# EAGLE schematic dashbutton_2450_v3 (EAGLE 9.1.3)
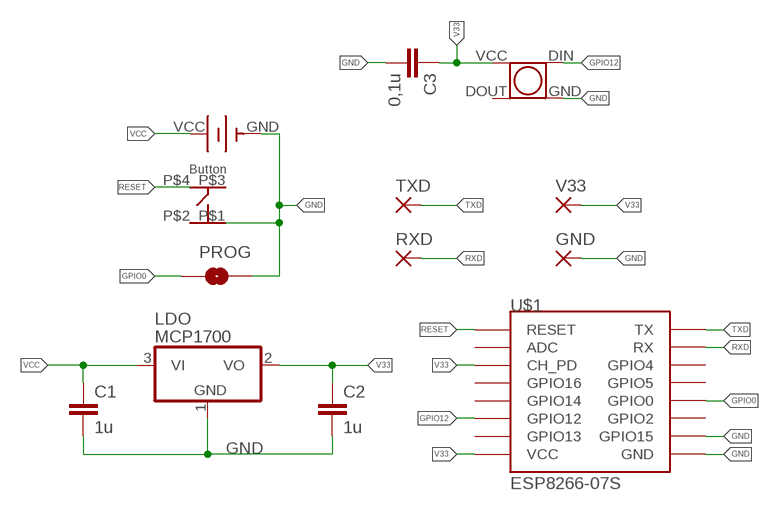
[diagram p0: schematic, sheet 1]

## Parts
BUTTON  OMRON_B3FS_BUTTON  [BUTTON_OMRON_B3FS]
C1  1u  C-EUC1206  [C1206]
C2  1u  C-EUC1206  [C1206]
C3  0,1u  C-EUC1206  [C1206]
GND  WIREPADSMD1,27-254  [SMD1,27-2,54]
LDO  MCP1700  MCP1703CB  [SOT23]
PROG  JUMPER-SMT_2_NO_NO-SILK  [SMT-JUMPER_2_NO_NO-SILK]
RXD  WIREPADSMD1,27-254  [SMD1,27-2,54]
TXD  WIREPADSMD1,27-254  [SMD1,27-2,54]
U$1  ESP8266-07S  [ESP8266-07S]
U$2  2450_BATTERYHOLDER_SMD  [2450_BATTERYHOLDER_SMD]
U$3  WS2812B  [WS2812B]
V33  WIREPADSMD1,27-254  [SMD1,27-2,54]

## Nets
GND: BUTTON.P$1(P1) C1.2 C2.2 C3.2 GND.1(P) LDO.1(GND) PROG.2 U$1.GND U$1.GPIO15 U$2.GND U$3.GND
GPIO0: PROG.1 U$1.GPIO0
GPIO12: U$1.GPIO12 U$3.DIN
RESET: BUTTON.P$4(P4) U$1.RST(RESET)
RXD: RXD.1(P) U$1.RXD(RX)
TXD: TXD.1(P) U$1.TXD(TX)
V33: C2.1 C3.1 LDO.2(VO) U$1.EN(CH_PD) U$1.VCC U$3.VCC V33.1(P)
VCC: C1.1 LDO.3(VI) U$2.VCC
Unconnected: BUTTON.P$2(P2) BUTTON.P$3(P3) U$1.ADC U$1.GPIO2 U$1.GPIO4 U$1.GPIO5 U$1.GPIO13 U$1.GPIO14 U$1.GPIO16 U$3.DOUT

## Library data of the parts
BUTTON = moekoe:OMRON_B3FS_BUTTON
C1-C3 = rcl:C-EU: CAPACITOR, European symbol; SPICEPREFIX: C
GND RXD TXD V33 = wirepad:WIREPAD: Wire PAD connect wire on PCB
LDO = linear:MCP1703: 250 mA, 16V, Low Quiescent Current LDO Regulator Source: http://ww1.microchip.com/downloads/en/DeviceDoc/22049b.pdf
PROG = SparkFun-Jumpers:JUMPER-SMT_2_NO: Normally open jumper This jumper has two pads in close proximity to each other. Apply solder to close the connection. Round pads are easier to solder for beginners, but are a lot larger. SparkFun Product that uses the round pads: SparkFun EL Sequencer <https://www.sparkfun.com/products/12781>
U$1 = moekoe:ESP8266-07S
U$2 = moekoe:2450_BATTERYHOLDER_SMD
U$3 = moekoe:WS2812B